# Altium schematic sheet enviornment_IMU.SchDoc
size A; SheetNumber: 2; SheetTotal: 5
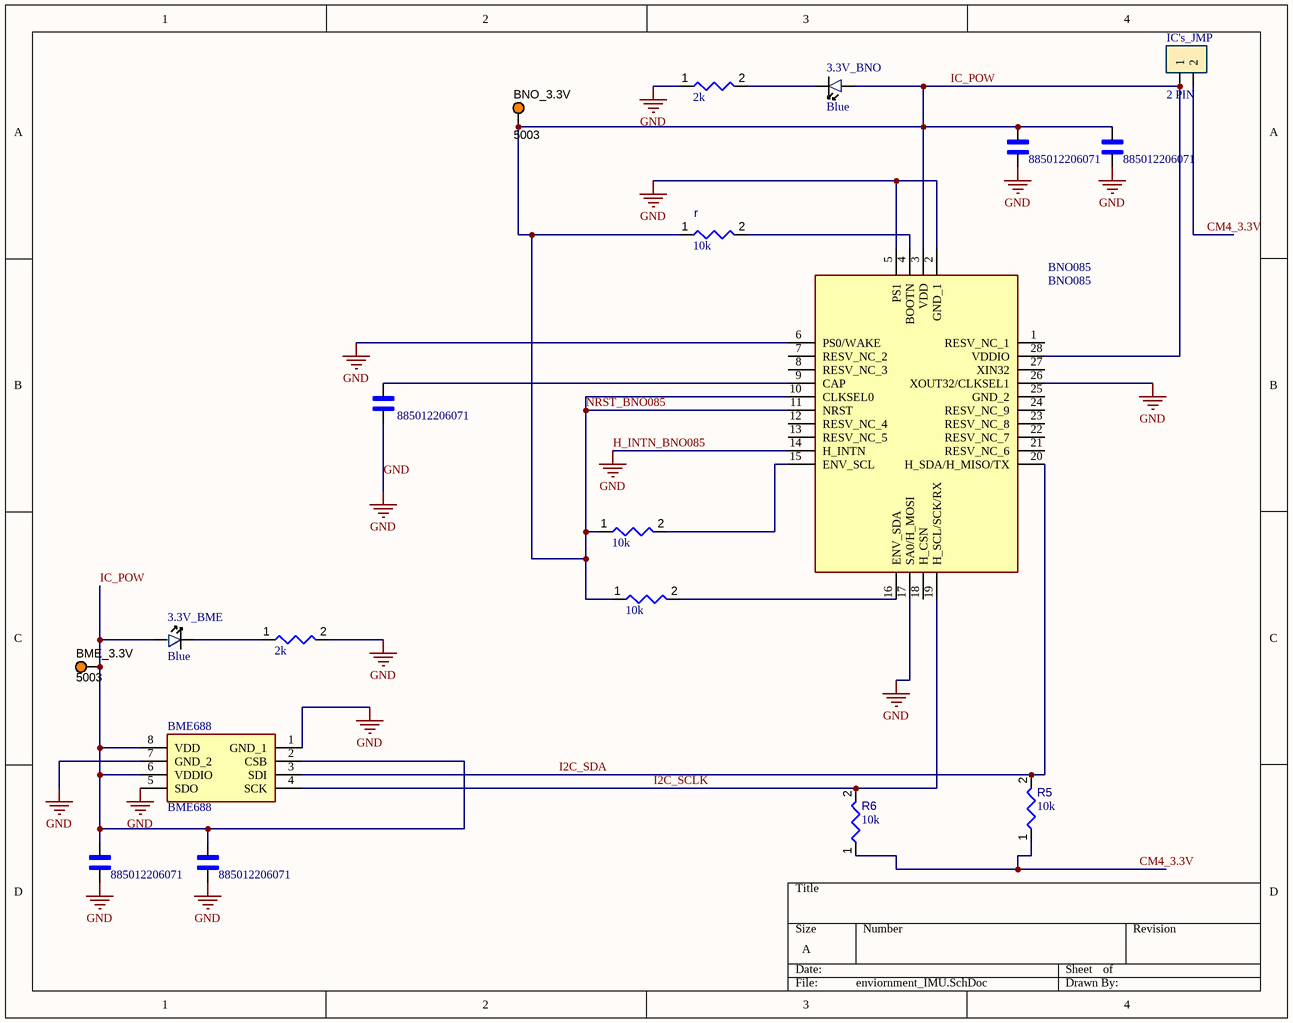
[diagram p0: enviornment_IMU.SchDoc]

## Parts
(Parts that share a designator on the sheet are numbered #1, #2 ... from top to bottom, then left to right.)
3.3V_BME  value Blue  [LED_0603]  (hidden comment: 0603Bl)
3.3V_BNO  value Blue  [LED_0603]  (hidden comment: 0603Bl)
?#1  value 2k  [RESC2013X50X35ML15T15]  (hidden comment: Resistor 10k +/-1% 0805 125 mW)
?#2  885012206071  [WCAP-CSGP_885012206071]
?#3  885012206071  [WCAP-CSGP_885012206071]
?#4  885012206071  [WCAP-CSGP_885012206071]
?#5  value 10k  [RESC2013X50X35ML15T15]  (hidden comment: Resistor 10k +/-1% 0805 125 mW)
?#6  value 10k  [RESC2013X50X35ML15T15]  (hidden comment: Resistor 10k +/-1% 0805 125 mW)
?#7  value 2k  [RESC2013X50X35ML15T15]  (hidden comment: Resistor 10k +/-1% 0805 125 mW)
?#8  885012206071  [WCAP-CSGP_885012206071]
?#9  885012206071  [WCAP-CSGP_885012206071]
BME688  BME688  [BME688]
BME_3.3V  5003  [KSTN-5003]
BNO085  BNO085  [BNO085]
BNO_3.3V  5003  [KSTN-5003]
IC's_JMP  2 PIN  [2_PIN_100MIL]
r  value 10k  [RESC2013X50X35ML15T15]  (hidden comment: Resistor 10k +/-1% 0805 125 mW)
R5  value 10k  [RESC2013X50X35ML15T15]  (hidden comment: Resistor 10k +/-1% 0805 125 mW)
R6  value 10k  [RESC2013X50X35ML15T15]  (hidden comment: Resistor 10k +/-1% 0805 125 mW)

## Nets
GND: ?#1.1 ?#2.2 ?#3.2 ?#4.2 ?#7.2 ?#8.2 ?#9.2 BME688.1(GND_1) BME688.5(SDO) BME688.7(GND_2) BNO085.2(GND_1) BNO085.5(PS1) BNO085.6(PS0/WAKE) BNO085.14(H_INTN) BNO085.17(SA0/H_MOSI) BNO085.26(XOUT32/CLKSEL1)  [also labelled H_INTN_BNO085]
CM4_3.3V: IC's_JMP.2 R5.1 R6.1
I2C_SCLK: BME688.4(SCK) BNO085.19(H_SCL/SCK/RX) R6.2
I2C_SDA: BME688.3(SDI) BNO085.20(H_SDA/H_MISO/TX) R5.2
IC_POW: 3.3V_BME.1 3.3V_BNO.1 ?#2.1 ?#3.1 ?#5.1 ?#6.1 ?#8.1 ?#9.1 BME688.2(CSB) BME688.6(VDDIO) BME688.8(VDD) BME_3.3V.1 BNO085.3(VDD) BNO085.10(CLKSEL0) BNO085.11(NRST) BNO085.28(VDDIO) BNO_3.3V.1 IC's_JMP.1 r.1  [also labelled NRST_BNO085]
Net3.3V_BME_2: 3.3V_BME.2 ?#7.1
Net3.3V_BNO_2: 3.3V_BNO.2 ?#1.2
Net?#4_1: ?#4.1 BNO085.9(CAP)
Net?#5_2: ?#5.2 BNO085.15(ENV_SCL)
Net?#6_2: ?#6.2 BNO085.16(ENV_SDA)
NetBNO085_4: BNO085.4(BOOTN) r.2

Not connected (* = marked no-connect by the designer): BNO085 1(RESV_NC_1) 7(RESV_NC_2) 8(RESV_NC_3) 12(RESV_NC_4) 13(RESV_NC_5) 18(H_CSN) 21(RESV_NC_6) 22(RESV_NC_7) 23(RESV_NC_8) 24(RESV_NC_9) 25(GND_2) 27(XIN32)

## Library data of the parts
3.3V_BME 3.3V_BNO = LED_BLUE_0603: LIGHT EMITTING DIODES (LED) BLUE 465~475NM 11.5~28.5MCD@5MA TOP VIEW 0603 ROHS; MFR Part #: 19-217/BHC-ZL1M2RY/3T; LCSC Part#: C72041; Type: Basic
?#1 ?#5-?#7 r R5 R6 = CMP-009-00018-5: Chip Resistor, 10 KOhm, +/- 1%, 125 mW, -55 to 155 degC, 0805 (2012 Metric); Power: 125mW; Voltage Rating: 150V; Tolerance: 1%; Pins: 2; Min Operating Temperature: -55°C; Case/Package: 0805; Max Operating Temperature: 155°C; RoHS Compliant: True; Mounting Technology: SM
?#2-?#4 ?#8 ?#9 = 885012206071: WCAP-CSGP General Purpose MLCC; SMT 0603; X7R; 100nF 10%; 25V; -55C to +125C; Tech. PN X7R0603104K025DFCT10000; MF: Wurth Electronics Inc; Package: 0603 Wurth Electronics; Purchase-URL: https://pricing.snapeda.com/search/part/885012206071/?ref=eda; Price: None; Value: *; Availability: Warning; MP: 885012206071; SnapEDA_Link: https://www.snapeda.com/parts/885012206071/Wurth%20Electronics%20Inc/view-part/4217095/?ref=snap
BME688 = BME688: Gas sensor measuring relative humidity, barometric pressure, ambient temperature and gas (VOC); Manufacturer_Name: BOSCH; Geometry.Height: 1mm; Manufacturer_Part_Number: BME688; Mouser Part Number: 262-BME688; Mouser Price/Stock: https://www.mouser.co.uk/ProductDetail/Bosch-Sensortec/BME688?qs=IS%252B4QmGtzzqQoVDscqwx3A%3D%3D; Arrow Part Number: BME688; Arrow Price/Stock: https://www.arrow.com/en/products/bme688/bosch?region=europe; Datasheet Link: https://www.bosch-sensortec.com/media/boschsensortec/downloads/datasheets/bst-bme688-ds000.pdf
BME_3.3V BNO_3.3V = CMP-002-00037-2: Test Point, Orange, Height 4.6 mm, Tail Length 3 mm, 1-Pin THD, RoHS; Manufacturer: Keystone; Colour: Orange; Packaging: Bulk; Package Description: 1-Pin Through Hole Device, Dia 2.54 mm; Pins: 1; Package Reference: 5003; Datasheet Version: Jun-15; Case/Package: 5003; Mounting Technology: TH; Connector Type: TestPoint; Diameter: 2.54mm; Contact Material: Bronze; Datasheet URL: http://keyelco.com/userAssets/file/M65p56.pdf; Manufacturer URL: http://www.keyelco.com/; Package Quantity: 10; Contact Plating: Tin; RoHS Compliant: True
BNO085 = BNO085: IMU ACCEL/GYRO/MAG I2C 32BIT; Manufacturer_Name: Hillcrest Laboratories, Inc.; Geometry.Height: 1.18mm; Manufacturer_Part_Number: BNO085; Mouser Part Number: *; Mouser Price/Stock: *; Arrow Part Number: *; Arrow Price/Stock: *; Datasheet Link: https://www.hillcrestlabs.com/downloads/bno080-datasheet
IC's_JMP = JM_2_PIN_MALE: 2.54mm Straight 2 1 Header，Breakaway Through Hole,P=2.54mm Pin Header & Female Header ROHS; MFR Part #: B-2100S02P-A110; Type: Extended; Datasheet: https://datasheet.lcsc.com/lcsc/1811151421_Ckmtw-Shenzhen-Cankemeng-B-2100S02P-A110_C124375.pdf; LCSC Part#: C124375; Value: 2 PIN